# EAGLE design emonPi_v2.0.0_CT_ext (EAGLE 9.6.2)
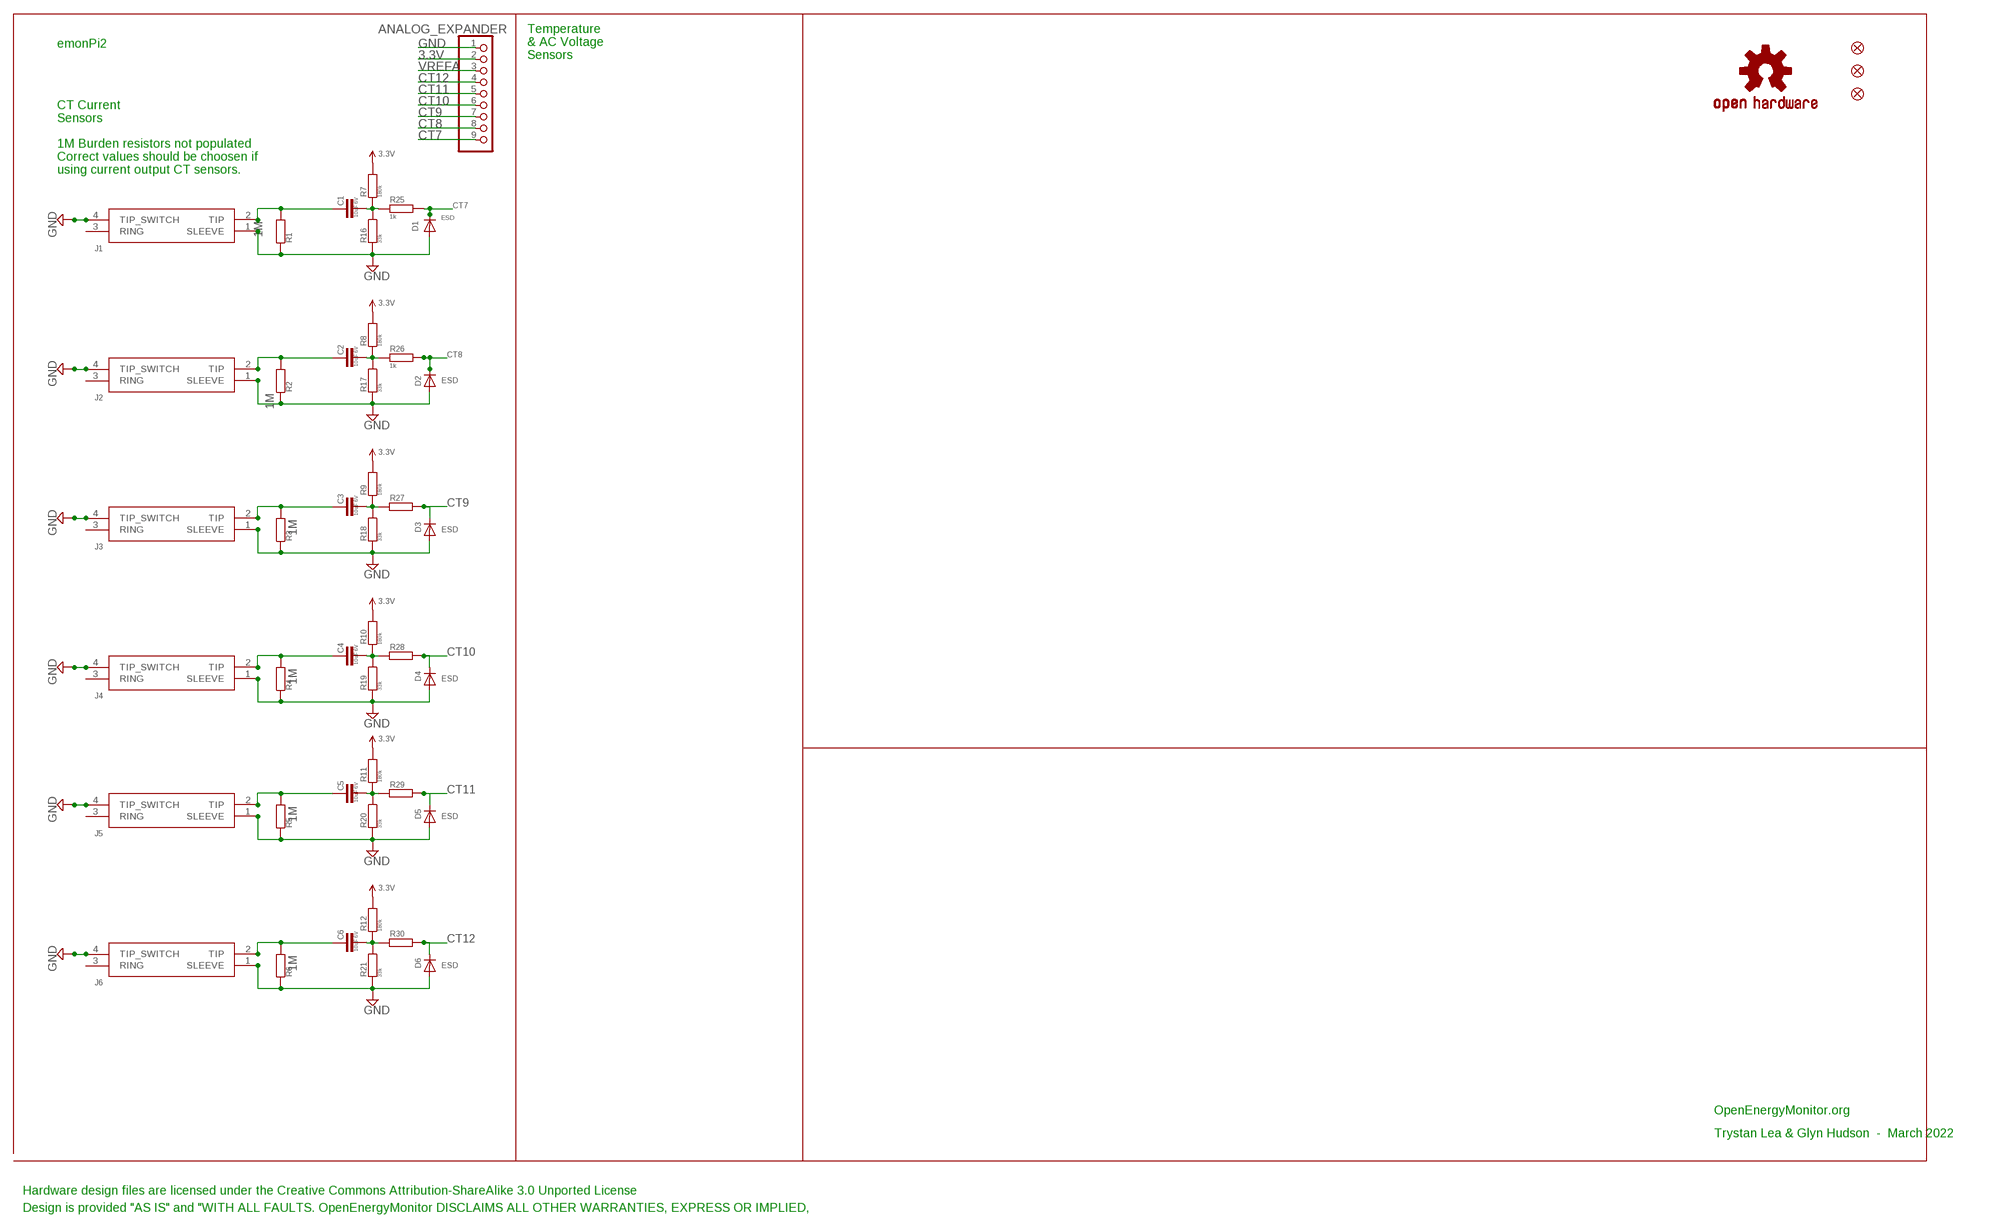
[diagram p0: schematic, sheet 1]

## Parts
ANALOG_EXPANDER  PINHD-1X9  [1X09-BIG]
C1  10uF 6V  C-EUC0603  [C0603]
C2  10uF 6V  C-EUC0603  [C0603]
C3  10uF 6V  C-EUC0603  [C0603]
C4  10uF 6V  C-EUC0603  [C0603]
C5  10uF 6V  C-EUC0603  [C0603]
C6  10uF 6V  C-EUC0603  [C0603]
D1  ESD  DIODESOD-523  [SOD-523]
D2  ESD  DIODESOD-523  [SOD-523]
D3  ESD  DIODESOD-523  [SOD-523]
D4  ESD  DIODESOD-523  [SOD-523]
D5  ESD  DIODESOD-523  [SOD-523]
D6  ESD  DIODESOD-523  [SOD-523]
FD1  FIDUCIAL1X2  [FIDUCIAL-1X2]
FD2  FIDUCIAL1X2  [FIDUCIAL-1X2]
FD3  FIDUCIAL1X2  [FIDUCIAL-1X2]
J1  SJ-3524-SMT-TR  [SJ-3524-SMT-TR]
J2  SJ-3524-SMT-TR  [SJ-3524-SMT-TR]
J3  SJ-3524-SMT-TR  [SJ-3524-SMT-TR]
J4  SJ-3524-SMT-TR  [SJ-3524-SMT-TR]
J5  SJ-3524-SMT-TR  [SJ-3524-SMT-TR]
J6  SJ-3524-SMT-TR  [SJ-3524-SMT-TR]
LOGO1  OSHW-LOGOS-COPPER  [OSHW-LOGO-S_COPPER]
R1  1M  R-EU_R1206  [R1206]
R2  1M  R-EU_R1206  [R1206]
R3  1M  R-EU_R1206  [R1206]
R4  1M  R-EU_R1206  [R1206]
R5  1M  R-EU_R1206  [R1206]
R6  1M  R-EU_R1206  [R1206]
R7  180k  R-EU_R0603  [R0603]
R8  180k  R-EU_R0603  [R0603]
R9  180k  R-EU_R0603  [R0603]
R10  180k  R-EU_R0603  [R0603]
R11  180k  R-EU_R0603  [R0603]
R12  180k  R-EU_R0603  [R0603]
R16  33k  R-EU_R0603  [R0603]
R17  33k  R-EU_R0603  [R0603]
R18  33k  R-EU_R0603  [R0603]
R19  33k  R-EU_R0603  [R0603]
R20  33k  R-EU_R0603  [R0603]
R21  33k  R-EU_R0603  [R0603]
R25  1k  R-EU_R0603  [R0603]
R26  1k  R-EU_R0603  [R0603]
R27  1k  R-EU_R0603  [R0603]
R28  1k  R-EU_R0603  [R0603]
R29  1k  R-EU_R0603  [R0603]
R30  1k  R-EU_R0603  [R0603]

## Nets
3.3V: ANALOG_EXPANDER.2 R7.2 R8.2 R9.2 R10.2 R11.2 R12.2
CT7: ANALOG_EXPANDER.9 D1.K(C) R25.2
CT8: ANALOG_EXPANDER.8 D2.K(C) R26.2
CT9: ANALOG_EXPANDER.7 D3.K(C) R27.1
CT10: ANALOG_EXPANDER.6 D4.K(C) R28.1
CT11: ANALOG_EXPANDER.5 D5.K(C) R29.1
CT12: ANALOG_EXPANDER.4 D6.K(C) R30.1
GND [gnd]: ANALOG_EXPANDER.1 D1.A D2.A D3.A D4.A D5.A D6.A J1.1(SLEEVE) J1.4(TIP_SWITCH) J2.1(SLEEVE) J2.4(TIP_SWITCH) J3.1(SLEEVE) J3.4(TIP_SWITCH) J4.1(SLEEVE) J4.4(TIP_SWITCH) J5.1(SLEEVE) J5.4(TIP_SWITCH) J6.1(SLEEVE) J6.4(TIP_SWITCH) R1.1 R2.1 R3.1 R4.1 R5.1 R6.1 R16.2 R17.2 R18.2 R19.2 R20.2 R21.2
N$1: C1.1 J1.2(TIP) R1.2
N$3: C3.1 J3.2(TIP) R3.2
N$5: C4.1 J4.2(TIP) R4.2
N$13: C2.1 J2.2(TIP) R2.2
N$14: C5.1 J5.2(TIP) R5.2
N$15: C5.2 R11.1 R20.1 R29.2
N$16: C2.2 R8.1 R17.1 R26.1
N$17: C4.2 R10.1 R19.1 R28.2
N$18: C1.2 R7.1 R16.1 R25.1
N$19: C6.1 J6.2(TIP) R6.2
N$20: C6.2 R12.1 R21.1 R30.2
N$21: C3.2 R9.1 R18.1 R27.2
VREFA: ANALOG_EXPANDER.3
Unconnected: J1.3(RING) J2.3(RING) J3.3(RING) J4.3(RING) J5.3(RING) J6.3(RING)

## Notes on the sheet
- emonPi2
- Temperature 
  & AC Voltage
  Sensors
- CT Current 
  Sensors
- 1M Burden resistors not populated
  Correct values should be choosen if 
  using current output CT sensors.
- OpenEnergyMonitor.org
- Trystan Lea & Glyn Hudson  -  March 2022
- Hardware design files are licensed under the Creative Commons Attribution-ShareAlike 3.0 Unported License
- Design is provided "AS IS" and "WITH ALL FAULTS. OpenEnergyMonitor DISCLAIMS ALL OTHER WARRANTIES, EXPRESS OR IMPLIED,

## Library data of the parts
ANALOG_EXPANDER = adafruit:PINHD-1X9: Pin header 1x10 0.1" spacing With round pins
C1-C6 = resistor:C-EU: CAPACITOR, European symbol
D1-D6 = microbuilder:DIODE: Diode SMA Model Volts Amps Type Vf Vr Digikey # Notes SSA34-E3 40V 3A Schottky 480mV @ 3A 200uA @ 40V SSA34-E3/61TGITR-ND CDBA120-G 20V 1A Schottky 500mV @ 1A 500uA @ 20V 641-1014-6-ND REEL MBRA210 10V 2A Schottky 350mV @ 2A 700uA @ 10V MBRA210LT3 SOD-123 Model Volts Amps Type Vf Vr Order # Notes BAT54T1G 30V 200mA Schottky 800mV @ 200mA 2uA @ 25V BAT54T1GOSTR-ND B0530W 30V 500mA Schottky 430mV @ 500mA 130uA @ 30V B0530W-FDICT-ND REEL MBR120 1A 20V Schottky 340mV @ 1A MBR120VLSFT1GOSCT-ND SOD-323 Model Volts Amps Type Vf Vr Order # Notes PMEG2005EJ 20V 500mA Schottky 355mV @ 500mA 568-4110-1-ND ZLLS410 10V 570mA Schottky 380mV @ 570mA ZLLS410CT-ND 1N4148WS 75V 150mA Silicon/Simple 1V 1N4148WSFSCT-ND REEL SOD-523 Model Volts Amps Type Vf Vr Order # Notes BAT54XV2 30V 200mA Schottky 0.8V @ 100mA BAT54XV2CT-ND TB751S 30V 30mA Schottky RB751S-40TE61CT-ND SOT23-R/W (R = Solder Paste/Reflow Ovens, W = Hand-Soldering) Model Volts Amps Type Vf Vr Order # Notes BAT54FILM 40V 300mA Schottky 497-7162-1-ND
FD1-FD3 = SparkFun-Aesthetics:FIDUCIAL: Fiducial Alignment Points Point-of-reference for pick-and-place machines and other optical instruments.
J1-J6 = SJ-3524-SMT-TR:SJ-3524-SMT-TR: Phone Connectors Audio Jacks Source: Datasheet <https://datasheet.datasheetarchive.com/originals/distributors/Datasheets-DGA1/151896.pdf>; ARROW_PART_NUMBER: SJ-3524-SMT-TR; ARROW_PRICE-STOCK: https://www.arrow.com/en/products/sj-3524-smt-tr/cui-devices?region=nac; DESCRIPTION: Phone Connectors Audio Jacks; HEIGHT: mm; MANUFACTURER_NAME: CUI Inc.; MANUFACTURER_PART_NUMBER: SJ-3524-SMT-TR; MOUSER_PART_NUMBER: 490-SJ-3524-SMT-TR; MOUSER_PRICE-STOCK: https://www.mouser.co.uk/ProductDetail/CUI-Devices/SJ-3524-SMT-TR?qs=WyjlAZoYn50%252B7OcNbxvx%252BA%3D%3D
LOGO1 = SparkFun-Aesthetics:OSHW-LOGO: Open-Source Hardware (OSHW) Logo This logo indicates the piece of hardware it is found on incorporates a OSHW license and/or adheres to the definition of open source hardware found here: http://freedomdefined.org/OSHW
R1-R12 R16-R21 R25-R30 = rcl:R-EU_: RESISTOR, European symbol

## Net classes
0 default: width 0.203 mm, drill 0.6 mm, clearance 0.203 mm
1 power: width 0.305 mm, drill 0.6 mm, clearance 0.254 mm
2 gnd: width 0.254 mm, drill 0.6 mm, clearance 0.254 mm
3 5V0_PI: width 0.406 mm, drill 0.4 mm
4 3V3_PI: width 0.254 mm, drill 0.4 mm

## Board
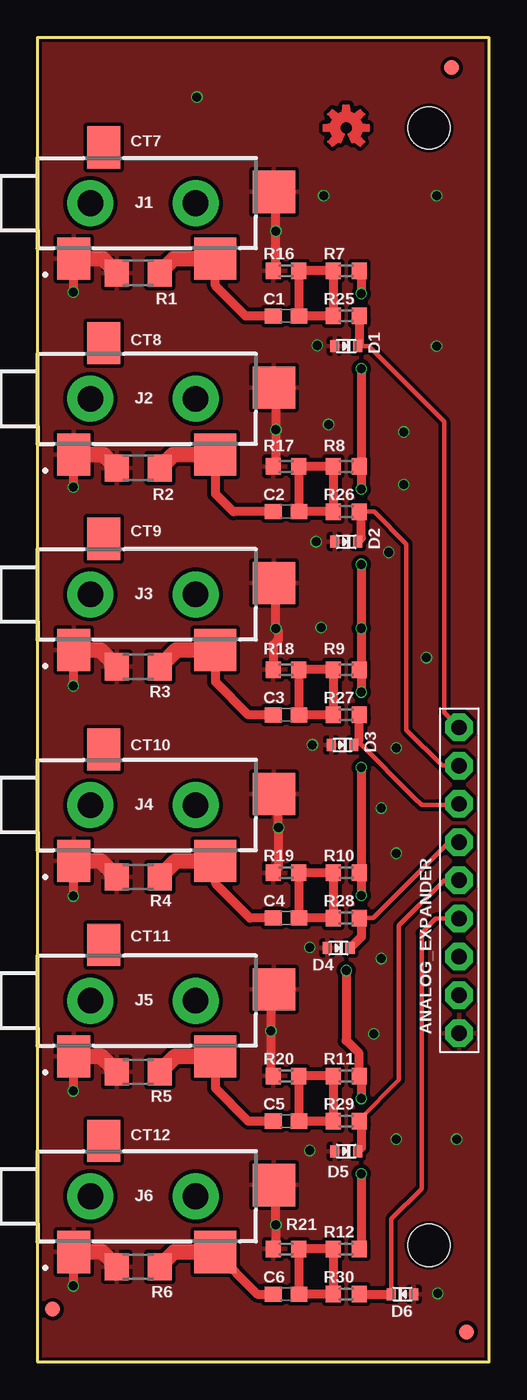
[diagram p1: board, top side]
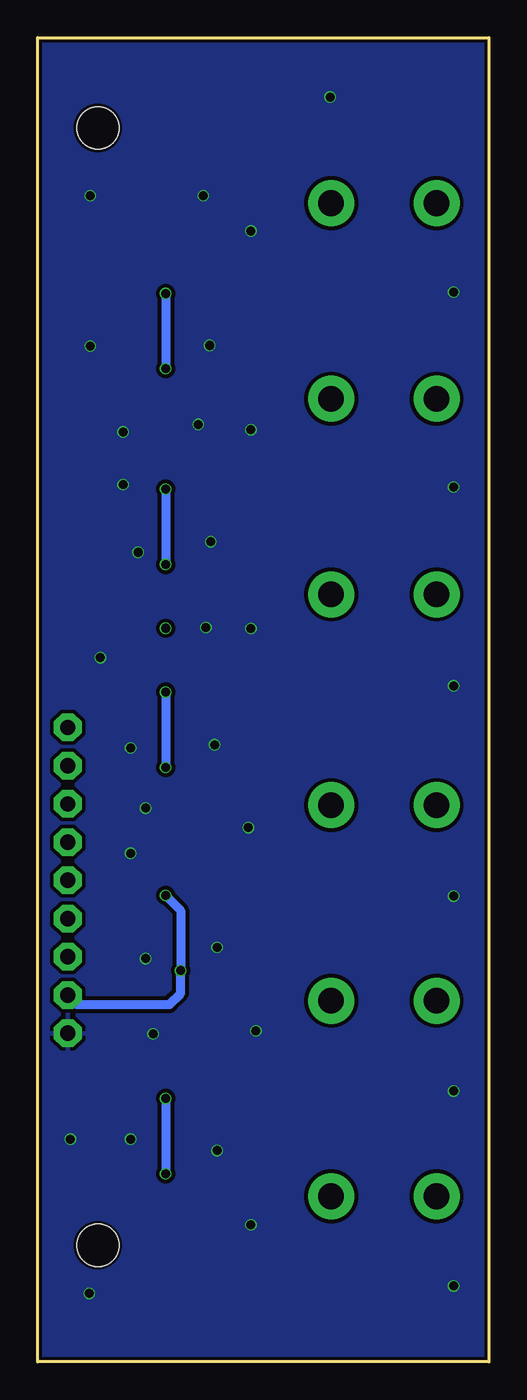
[diagram p2: board, bottom side, seen from below]

Size 30 x 88 mm. Coordinates in mm from the lower left corner, seen from the top.
Outline: 0,0 30,0 30,88 0,88 0,0
Copper layers (1*16): Top 0.035mm / dielectric 1.6mm / Bottom 0.035mm
Design rules "jlcpcb-2layers": minimum track width 5mil, minimum drill 0.3mm, track to track 5mil, track to pad 5mil, pad to pad 5mil, via to via 5mil, smd to smd 5mil, copper to edge 0.2mm, drill to drill 6mil, minimum pad ring 10mil, minimum via ring 3mil, stop-mask expansion 4mil, vias tented up to drill 0mil, thermal gap 10mil
Holes 2.8 mm at 26,7.75 26,82

### Footprints (pad centres in the part's own frame; a part is rotated, then mirrored left to right if it is on the bottom)
1X09-BIG = drill 1.016 pad 1.778 octagon: 1 -10.16,0; 2 -7.62,0; 3 -5.08,0; 4 -2.54,0; 5 0,0; 6 2.54,0; 7 5.08,0; 8 7.62,0; 9 10.16,0
C0603 = smd 1.1 x 1: 1 -0.85,0; 2 0.85,0
SOD-523 = smd 0.8 x 0.6: A 0,-0.75; K 0,0.75
FIDUCIAL-1X2 = smd 1 x 1: 1 0,0
SJ-3524-SMT-TR = smd 2.2 x 2.8: 1 2.4,-6.7; 3 4.4,0.7 | smd 2.8 x 2.8: 2 11.8,-6.7; 4 15.7,-2.25 | drill 1.7 pad 2.55: 5 3.5,-3; 6 10.5,-3
R1206 = smd 1.6 x 1.803: 1 -1.422,0; 2 1.422,0
R0603 = smd 1 x 1.1: 1 -0.85,0; 2 0.85,0

### Placement (x,y rotation side)
ANALOG_EXPANDER  28,32 90 top
C1  16.5,69.5 0 top
C2  16.5,56.5 0 top
C3  16.5,43 0 top
C4  16.5,29.5 0 top
C5  16.5,16 0 top
C6  16.5,4.5 0 top
D1  20.5,67.5 270 top
D2  20.5,54.5 270 top
D3  20.25,41 270 top
D4  20,27.5 270 top
D5  20.5,14 270 top
D6  24.25,4.5 90 top
FD1  1,3.5 0 top
FD2  28.5,2 0 top
FD3  27.5,86 0 top
J1  0,80 0 top
J2  0,67 0 top
J3  0,54 0 top
J4  0,40 0 top
J5  0,27 0 top
J6  0,14 0 top
LOGO1  20.5,82 0 top
R1  6.68,72.36 0 top
R2  6.68,59.4 0 top
R3  6.68,46.2 0 top
R4  6.68,32.23 0 top
R5  6.68,19.27 0 top
R6  6.68,6.32 0 top
R7  20.5,72.5 0 top
R8  20.5,59.5 0 top
R9  20.5,46 0 top
R10  20.5,32.5 0 top
R11  20.5,19 0 top
R12  20.5,7.5 0 top
R16  16.5,72.5 180 top
R17  16.5,59.5 180 top
R18  16.5,46 180 top
R19  16.5,32.5 180 top
R20  16.5,19 180 top
R21  16.5,7.5 180 top
R25  20.5,69.5 0 top
R26  20.5,56.5 0 top
R27  20.5,43 180 top
R28  20.5,29.5 180 top
R29  20.5,16 180 top
R30  20.5,4.5 180 top

### Tracks (layer width: path | path; a pad name or v marks a point on that pad's centre or on a via)
3.3V  (via drill 0.6)
  Top 0.61: v20.5,26 20.5,21.35 21.35,20.5 R11.2 21.5,18.85 v21.5,17.5 | R7.2 21.5,72.35 v21.5,71 | v21.5,66 21.5,59.65 R8.2 21.5,59.35 v21.5,58 | v21.5,53 v21.5,48.75 21.5,46.15 R9.2 21.5,45.85 v21.5,44.5 | v21.5,39.5 21.5,32.65 R10.2 21.5,32.35 v21.5,31 | R12.2 21.5,7.65 v21.5,12.5
  Bottom 0.61: v21.5,17.5 v21.5,12.5 | v21.5,71 v21.5,66 | v21.5,58 v21.5,53 | v21.5,44.5 v21.5,39.5 | v21.5,31 20.5,30 v20.5,26 20.5,24.5 21.25,23.75 27.37,23.75 ANALOG_EXPANDER.2
CT7
  Top 0.305: D1.K 22,67.5 27,62.5 27,43.16 ANALOG_EXPANDER.9
  Top 0.61: 21.59,69.26 R25.2 21.35,67.6 D1.K
CT8
  Top 0.305: R26.2 22.35,56.5 24.5,54.35 24.5,42 26.88,39.62 ANALOG_EXPANDER.8 | D2.K 21.35,54.6
  Top 0.61: R26.2 21.5,56.35 21.5,54.75 D2.K
CT9
  Top 0.203: 28.08,37.08 ANALOG_EXPANDER.7
  Top 0.305: ANALOG_EXPANDER.7 27.92,37 25.5,37 25,37.5 21.35,41.15 R27.1
  Top 0.61: 21.59,42.76 R27.1 21.35,41.35 D3.K
CT10
  Top 0.305: R28.1 22.29,29.5 27.33,34.54 ANALOG_EXPANDER.6
  Top 0.61: 21.59,29.26 R28.1 21.5,29.35 21.5,28.25 D4.K
CT11
  Top 0.254: 24,18.75 21.35,16.1 R29.1
  Top 0.305: 21.5,15.85 R29.1 | 24,18.75 24,29 27,32 ANALOG_EXPANDER.5
  Top 0.61: R29.1 21.59,15.76 | 21.5,15.85 21.5,14.25 D5.K
CT12
  Top 0.305: D6.K 23.5,9.5 25.5,11.5 25.5,28.5 26.46,29.46 ANALOG_EXPANDER.4
  Top 0.61: 21.55,4.3 R30.1 D6.K
GND  (via drill 0.6)
  Top 0.61: J1.1 2.37,73.27 v2.37,71.09 | J2.1 2.37,60.27 v2.37,58.13 | J3.1 2.37,47.27 v2.37,44.93 | J4.1 2.37,33.27 v2.37,30.96 | J5.1 2.37,20.27 v2.37,18 | J6.1 2.37,7.27 v2.37,5.05 | R21.2 15.83,7.68 v15.83,9.11 15.83,11.62 J6.4 | 15.19,23.73 15.7,24.24 J5.4 15.5,24.55 v15.5,22 15.5,19.15 R20.2 15.75,19.1 | R19.2 16,32.85 v16,35.5 16,37.45 J4.4 15.7,37.24 15.19,36.73 | 15.19,50.73 15.7,51.24 J3.4 15.83,51.62 v15.83,48.74 16,48.56 16,48 15.65,47.65 R18.2 | 16.34,64.11 J2.4 15.83,64.62 v15.83,61.94 15.83,59.68 R17.2 | R16.2 15.83,72.68 v15.83,75.15 15.83,77.62 J1.4
  Top 1.016: J1.1 4.32,73.3 R1.1 | J2.1 4.37,60.3 R2.1 | J3.1 4.16,47.3 R3.1 | J4.1 4.19,33.3 R4.1 | J5.1 4.23,20.3 R5.1 | J6.1 4.28,7.3 R6.1
  other vias: 18.25,41 18.5,54.5 22.83,36.8 18.08,27.55 23.83,14.8 18.08,14.05 26.58,4.55 18.58,67.55 10.58,84.05 27.83,14.8 22.33,21.8 22.83,26.8 23.83,33.8 25.83,46.8 23.83,40.8 24.33,61.8 24.33,58.3 26.5,67.5 26.5,77.5 23.33,53.8 18.83,48.8 19.33,62.3 19,77.5
  pour Bottom: -1.25,89 -1.25,-1 31.5,-1 31.5,89
  pour Top: -2.02,89 31,89 31,-1 -2.02,-1
N$1
  Top 0.61: C1.1 13.82,69.5 11.8,71.52 J1.2
  Top 1.016: R1.2 9.05,73.3 J1.2
N$3
  Top 0.61: C3.1 14,43 11.8,45.2 J3.2
  Top 1.016: R3.2 9.21,47.3 J3.2
N$5
  Top 0.61: C4.1 14.1,29.5 11.8,31.8 J4.2
  Top 1.016: R4.2 9.18,33.3 J4.2
N$13
  Top 0.61: C2.1 13,56.5 11.8,57.7 J2.2
  Top 1.016: J2.2 9,60.3 R2.2
N$14
  Top 0.61: C5.1 14,16 11.8,18.2 J5.2
  Top 1.016: R5.2 9.13,20.3 J5.2
N$15
  Top 0.61: R20.1 C5.2 R29.2 R11.1 R20.1
N$16
  Top 0.61: R8.1 R17.1 C2.2 R26.1 | R26.1 | 19.65,59 R26.1 | R26.1
N$17
  Top 0.61: R10.1 R28.2 C4.2 R19.1 R10.1 | R10.1
N$18
  Top 0.61: R25.1 R7.1 R16.1 C1.2 R25.1 | R25.1
N$19
  Top 0.61: J6.2 14.6,4.5 C6.1
  Top 1.016: J6.2 9.09,7.3 R6.2
N$20
  Top 0.61: R12.1 R21.1 C6.2 R30.2 R12.1
N$21
  Top 0.61: R27.2 C3.2 R18.1 R9.1 R27.2

### Text on the board
tPlace: CT7 | CT8 | CT9 | CT10 | CT11 | CT12
_tsilk: Designed in | North Wales | Made in UK
_bsilk: 165mm ant | 433Mhz | 165mm ant | 165mm ant | 433Mhz | 433Mhz | 868Mhz | 82mm ant | 82mm ant | 82mm ant | 868Mhz | 868Mhz | 78mm ant | 915Mhz | 78mm ant | 915Mhz | 78mm ant | 915Mhz | 165mm ant | 433Mhz | 82mm ant | 868Mhz | 78mm ant | 915Mhz